# Altium schematic sheet Connectors.SchDoc
size A4; SheetNumber: 8; SheetTotal: 8
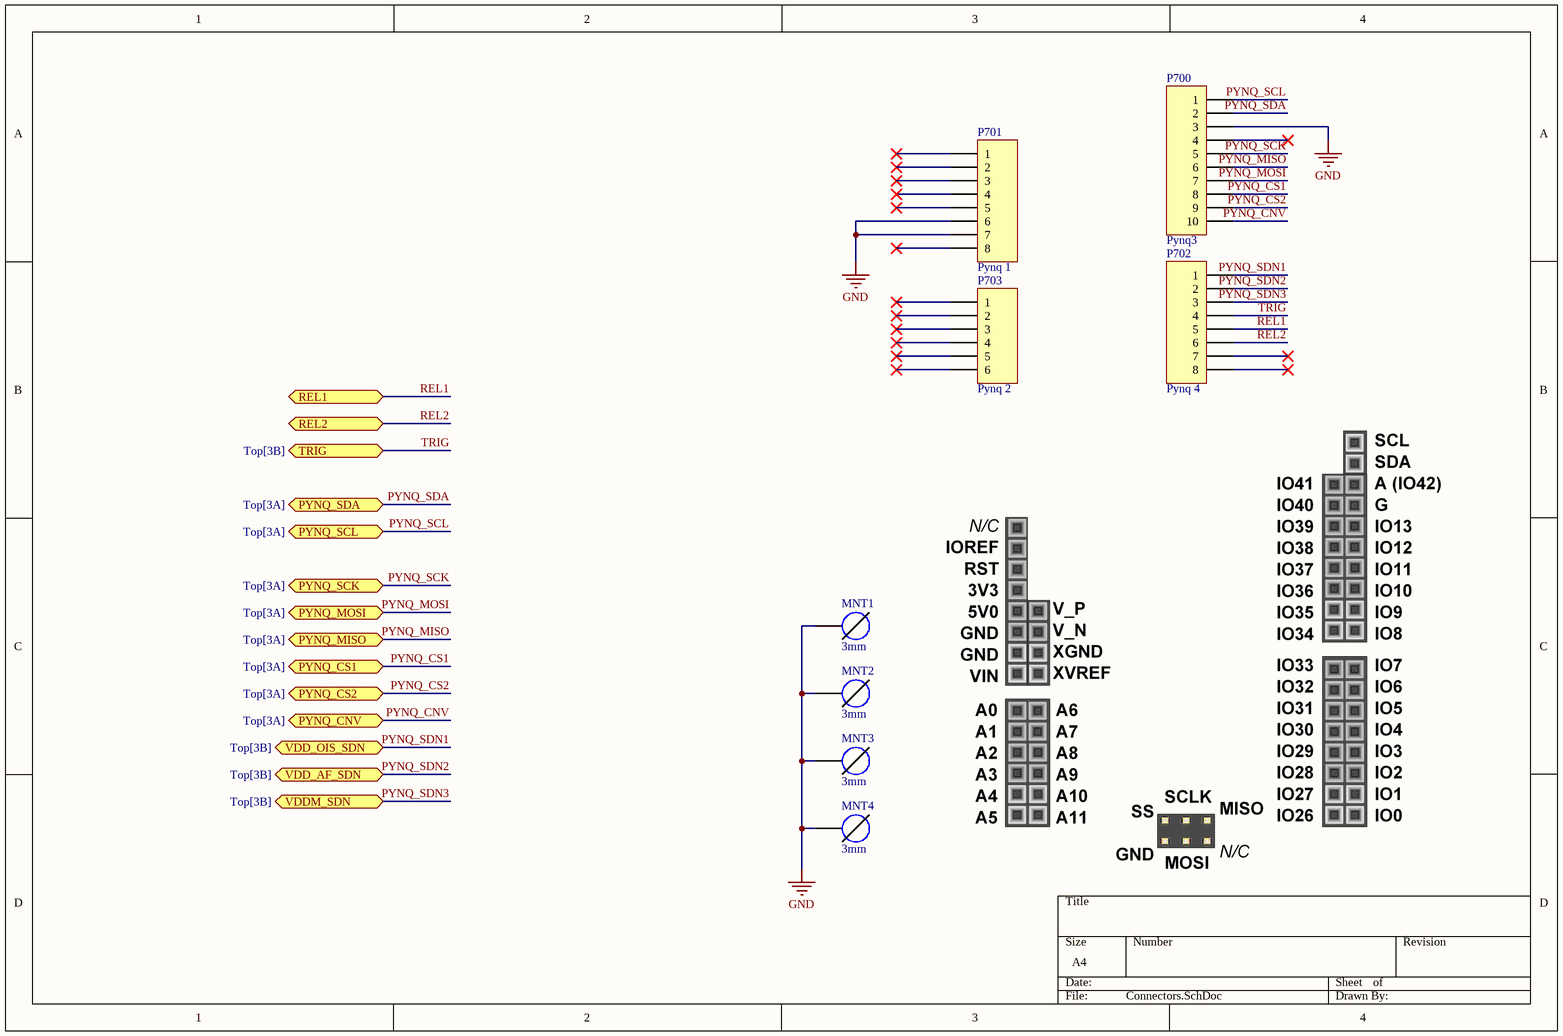
[diagram p0: Connectors.SchDoc]

## Parts
MNT1  3mm  [3mm Hole]
MNT2  3mm  [3mm Hole]
MNT3  3mm  [3mm Hole]
MNT4  3mm  [3mm Hole]
P700  Pynq3  [HDR1X10]
P701  Pynq 1  [HDR1X8]
P702  Pynq 4  [HDR1X8]
P703  Pynq 2  [HDR1X6]

## Ports
PYNQ_CNV (bidir, see Top[3A]), PYNQ_CS1 (bidir, see Top[3A]), PYNQ_CS2 (bidir, see Top[3A]), PYNQ_MISO (bidir, see Top[3A]), PYNQ_MOSI (bidir, see Top[3A]), PYNQ_SCK (bidir, see Top[3A]), PYNQ_SCL (bidir, see Top[3A]), PYNQ_SDA (bidir, see Top[3A]), REL1 (bidir), REL2 (bidir), TRIG (bidir, see Top[3B]), VDD_AF_SDN (bidir, see Top[3B]), VDD_OIS_SDN (bidir, see Top[3B]), VDDM_SDN (bidir, see Top[3B])

## Nets
GND: MNT1.1 MNT2.1 MNT3.1 MNT4.1 P700.3 P701.6 P701.7
PYNQ_CNV: P700.10 ; port PYNQ_CNV
PYNQ_CS1: P700.8 ; port PYNQ_CS1
PYNQ_CS2: P700.9 ; port PYNQ_CS2
PYNQ_MISO: P700.6 ; port PYNQ_MISO
PYNQ_MOSI: P700.7 ; port PYNQ_MOSI
PYNQ_SCK: P700.5 ; port PYNQ_SCK
PYNQ_SCL: P700.1 ; port PYNQ_SCL
PYNQ_SDA: P700.2 ; port PYNQ_SDA
PYNQ_SDN1: P702.1 ; port VDD_OIS_SDN
PYNQ_SDN2: P702.2 ; port VDD_AF_SDN
PYNQ_SDN3: P702.3 ; port VDDM_SDN
REL1: P702.5 ; port REL1
REL2: P702.6 ; port REL2
TRIG: P702.4 ; port TRIG

Not connected (* = marked no-connect by the designer): P700 4*; P701 1* 2* 3* 4* 5* 8*; P702 7* 8*; P703 1* 2* 3* 4* 5* 6*

## Library data of the parts
MNT1-MNT4 = Hole 3mm
P700 = Header 10: Header, 10-Pin; LatestRevisionDate: 17-Jul-2002; LatestRevisionNote: Re-released for DXP Platform.; Publisher: Altium Limited
P701 P702 = Header 8: Header, 8-Pin; LatestRevisionDate: 17-Jul-2002; LatestRevisionNote: Re-released for DXP Platform.; Publisher: Altium Limited
P703 = Header 6: Header, 6-Pin; LatestRevisionDate: 17-Jul-2002; LatestRevisionNote: Re-released for DXP Platform.; Publisher: Altium Limited